# Altium schematic sheet LoRaSnow_smol.SchDoc
size A4; CompanyName: HESSO; Address1: Route du Rawyl 47; Address2: 1950 Sion; Address3: Switzerland; PageSetup: Record=PageOptions|CenterHorizontal=True|CenterVertical=True|PrintScale=1.00|XCorrection=1.00|YCorrection=1.00|PrintKind=1|BorderSize=5000000|LeftOffset=0|BottomOffset=0|Orientation=2|PaperLength=1000|PaperWidth=1000|Scale=100|PaperSource=15|PrintQuality=1200|MediaType=1|DitherType=10|PrintScaleMode=1|PaperKind=A4|PaperIndex=9; ProjectName: Project Name
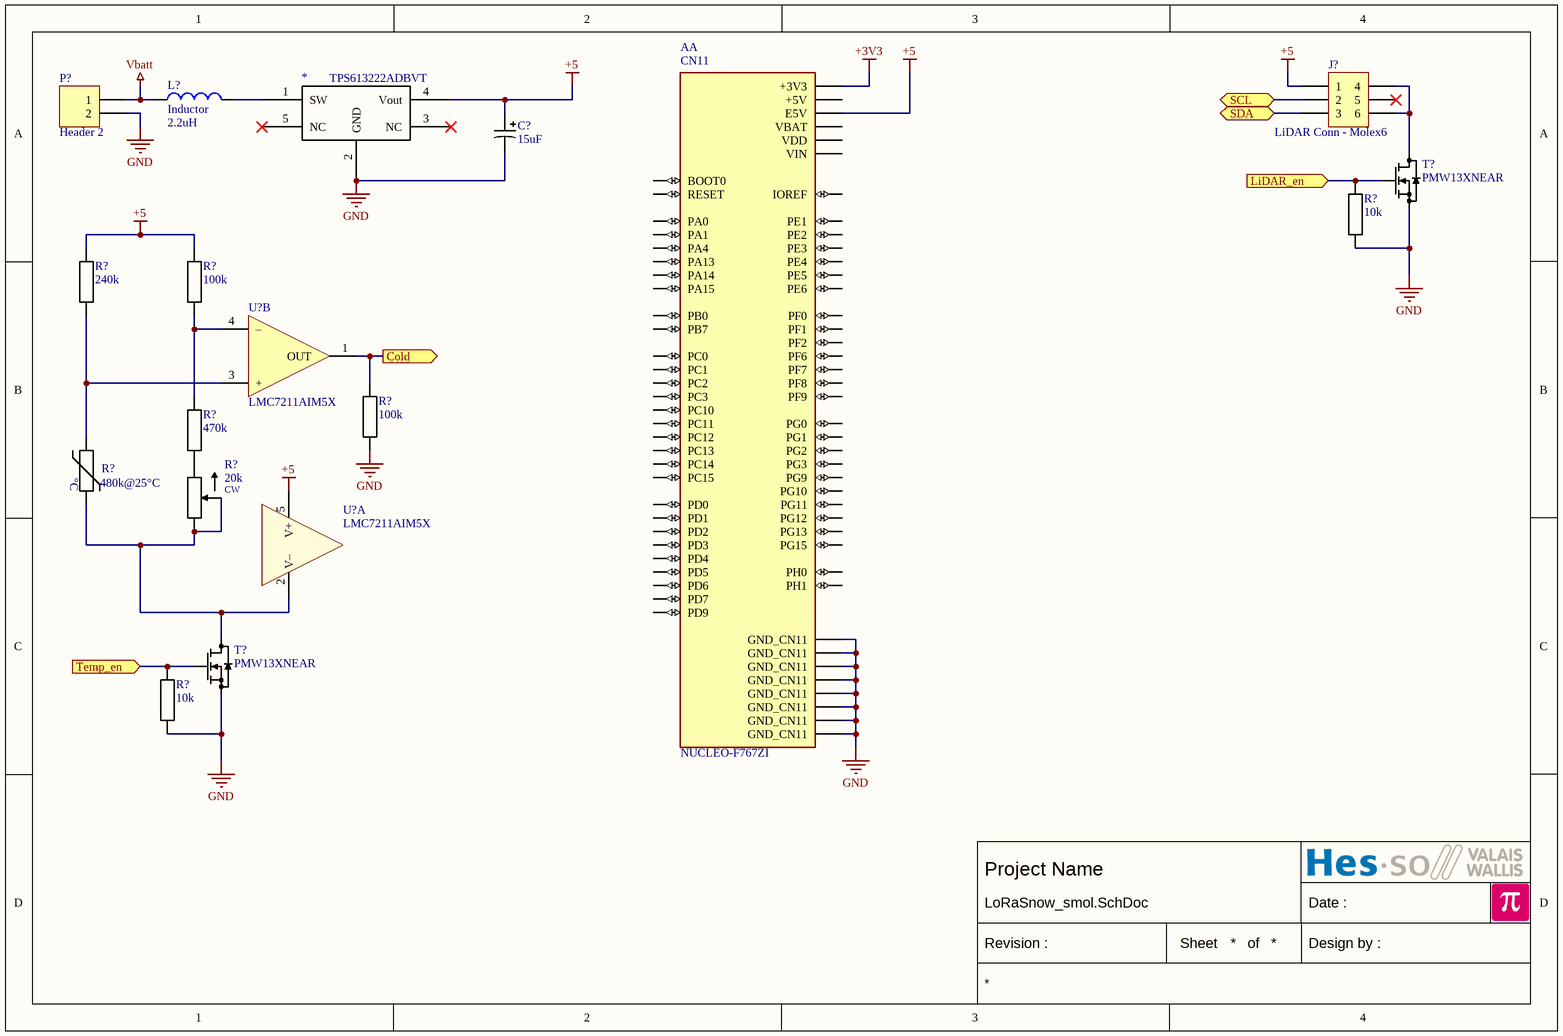
[diagram p0: LoRaSnow_smol.SchDoc]

## Parts
(Parts that share a designator on the sheet are numbered #1, #2 ... from top to bottom, then left to right.)
*  TPS613222ADBVT  [SOT23-5 P0.95 C1.6x3.0 H1.3]
A  NUCLEO-F767ZI  [ST_NUCLEO-F767ZI]  (part A of 6)
C?  15uF  [CAPACITOR POL 7343-43 REFLOW]
J?  LiDAR Conn - Molex6  [MOLEX 43045-0600]
L?  Inductor  value 2.2uH  [INDUCTOR 4532 REFLOW]
P?  Header 2  [XT60 Male]
R?#1  10k  [RESISTOR 1608 REFLOW]
R?#2  240k  [RESISTOR 1608 REFLOW]
R?#3  100k  [RESISTOR 1608 REFLOW]
R?#4  480k@25°C  [RESISTOR 1608 REFLOW]
R?#5  100k  [RESISTOR 1608 REFLOW]
R?#6  20k  [Trimmer BOURNS 3266W]
R?#7  470k  [RESISTOR 1608 REFLOW]
R?#8  10k  [RESISTOR 1608 REFLOW]
T?#1  PMW13XNEAR  [SOT23 P0.95 C1.6x3.0 H1.3]
T?#2  PMW13XNEAR  [SOT23 P0.95 C1.6x3.0 H1.3]
U?#1  LMC7211AIM5X  [SOT23-5 P0.95 C1.6x3.0 H1.3]  (part B of 2)
U?#2  LMC7211AIM5X  [SOT23-5 P0.95 C1.6x3.0 H1.3]  (part A of 2)

## Ports
Cold (out), LiDAR_en (in), SCL (bidir), SDA (bidir), Temp_en (in)

## Nets
+3V3: A.CN11_16(+3V3)
+5: *.4(Vout) A.CN11_6(E5V) C?.1 J?.1 R?#2.2 R?#3.2 U?#2.5(V+)
GND: *.2(GND) A.CN11_8(GND_CN11) A.CN11_19(GND_CN11) A.CN11_20(GND_CN11) A.CN11_22(GND_CN11) A.CN11_49(GND_CN11) A.CN11_60(GND_CN11) A.CN11_71(GND_CN11) A.CN11_72(GND_CN11) C?.2 P?.2 R?#1.1 R?#5.1 R?#8.1 T?#1.2(S) T?#2.2(S)
Vbatt: L?.1 P?.1
Cold: R?#5.2 U?#1.1(OUT) ; port Cold
LiDAR_en: R?#1.2 T?#1.1(G) ; port LiDAR_en
SCL: J?.2 ; port SCL
SDA: J?.3 ; port SDA
Temp_en: R?#8.2 T?#2.1(G) ; port Temp_en
Net*_1: *.1(SW) L?.2
NetJ?_4: J?.4 J?.6 T?#1.3(D)
NetR?#2_1: R?#2.1 R?#4.1 U?#1.3(+)
NetR?#3_1: R?#3.1 R?#7.2 U?#1.4(–)
NetR?#4_2: R?#4.2 R?#6.1 R?#6.2(WIPER) T?#2.3(D) U?#2.2(V–)
NetR?#6_3: R?#6.3 R?#7.1

Not connected (* = marked no-connect by the designer): * 3(NC)* 5(NC)*; A CN11_1(PC10) CN11_2(PC11) CN11_3(PC12) CN11_4(PD2) CN11_5(VDD) CN11_7(BOOT0) CN11_9(PF6) CN11_11(PF7) CN11_12(IOREF) CN11_13(PA13) CN11_14(RESET) CN11_15(PA14) CN11_17(PA15) CN11_18(+5V) CN11_21(PB7) CN11_23(PC13) CN11_24(VIN) CN11_25(PC14) CN11_27(PC15) CN11_28(PA0) CN11_29(PH0) CN11_30(PA1) CN11_31(PH1) CN11_32(PA4) CN11_33(VBAT) CN11_34(PB0) CN11_35(PC2) CN11_36(PC1) CN11_37(PC3) CN11_38(PC0) CN11_39(PD4) CN11_40(PD3) CN11_41(PD5) CN11_42(PG2) CN11_43(PD6) CN11_44(PG3) CN11_45(PD7) CN11_46(PE2) CN11_47(PE3) CN11_48(PE4) CN11_50(PE5) CN11_51(PF1) CN11_52(PF2) CN11_53(PF0) CN11_54(PF8) CN11_55(PD1) CN11_56(PF9) CN11_57(PD0) CN11_58(PG1) CN11_59(PG0) CN11_61(PE1) CN11_62(PE6) CN11_63(PG9) CN11_64(PG15) CN11_65(PG12) CN11_66(PG10) CN11_68(PG13) CN11_69(PD9) CN11_70(PG11); J? 5*

## Notes on the sheet
- Date :
- Revision :
- Sheet
- of
- Design by :
- (in symbol NUCLEO-F767ZI, part A) CN11
- (in symbol Thermal Resistor) °C

## Library data of the parts
A = NUCLEO-F767ZI: STM32F767, mbed-Enabled Development Nucleo-144 STM32F7 ARMÂ® CortexÂ®-M7 MCU 32-Bit Embedded Evaluation Board; MF: STMicroelectronics; Value: *; MP: NUCLEO-F767ZI; Package: None; Price: None; Availability: Unavailable; SnapEDA_Link: https://www.snapeda.com/parts/NUCLEO-F767ZI/STMicroelectronics/view-part/562019/?ref=snap
C? = Capacitor Polarized: Value: 15uF
J? = MOLEX 43045-0600: Micro-Fit 3.0 Right-Angle Header, 3.00mm Pitch, Dual Row, 6 Circuits
L? = Inductor: Code_IEC: 1005; Published: 8-Jun-2000; LatestRevisionDate: 29-May-2009; LatestRevisionNote: IPC-7351 Footprint Added.; PackageReference: 0402-A; Publisher: Altium Limited; PackageDescription: Chip Inductor; Code_JEITA: 0402
P? = Header 2: Header, 2-Pin; LatestRevisionDate: 17-Jul-2002; LatestRevisionNote: Re-released for DXP Platform.; Publisher: Altium Limited
R?#1-R?#3 R?#5 R?#7 R?#8 = Resistor
  R?#1 R?#8: Value: 10k
  R?#2: Value: 240k
  R?#3 R?#5: Value: 100k
  R?#7: Value: 470k
R?#4 = Thermal Resistor: Value: 480k@25°C
R?#6 = Trimmer: Value: 20k; CW: CW
T?#1 T?#2 = MOS-N SOT23 G-S-D: Generic MOS-N; Value: PMW13XNEAR
U?#1 U?#2 = COMPARATOR SINGLE SOT23-5: Generic Single Comparator 5pins 1OUT/2-V/3+IN/4-IN/5+V; Value: LMC7211AIM5X